# EAGLE schematic apu_module (EAGLE 6.5.0)
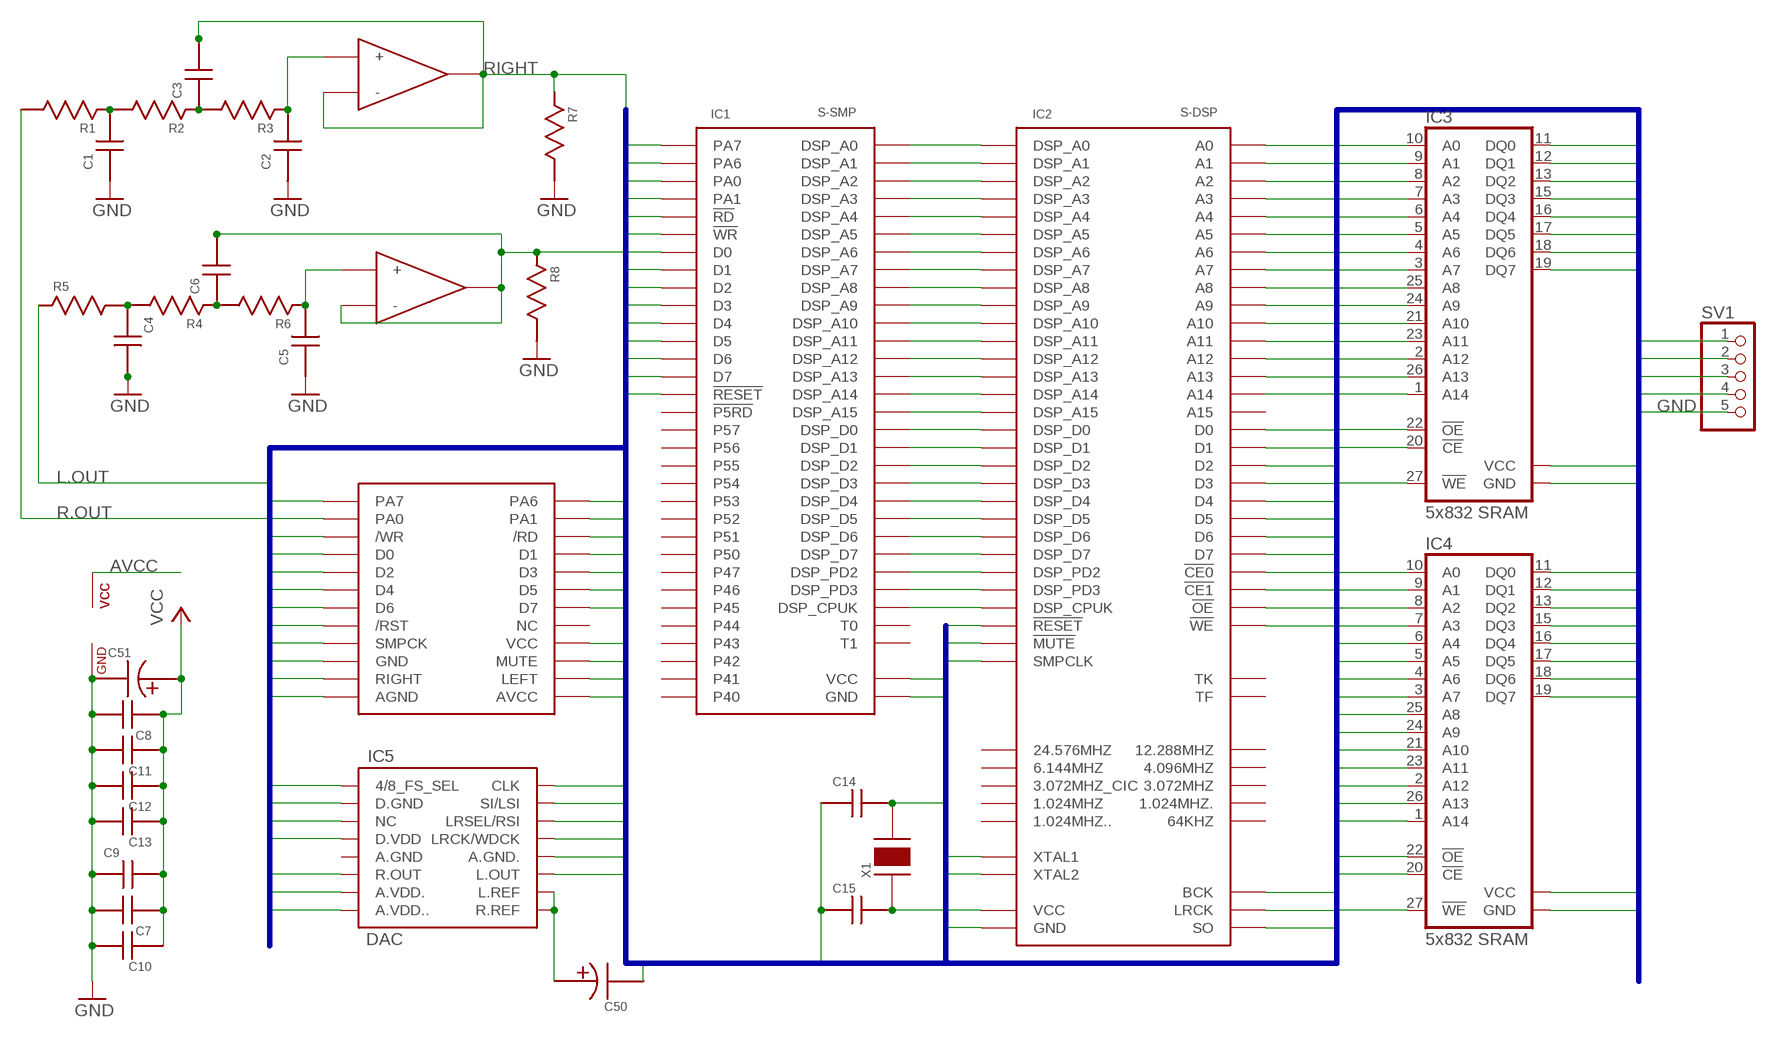
[diagram p0: schematic, sheet 1]

## Parts
C1  C0805  [C0805]
C2  C0805  [C0805]
C3  C0805  [C0805]
C4  C0805  [C0805]
C5  C0805  [C0805]
C6  C0805  [C0805]
C7  C0805  [C0805]
C8  C0805  [C0805]
C9  C0805  [C0805]
C10  C0805  [C0805]
C11  C0805  [C0805]
C12  C0805  [C0805]
C13  C0805  [C0805]
C14  C0805  [C0805]
C15  C0805  [C0805]
C50  CAPACITOR  [TT5D6]
C51  CAPACITOR  [TT5D6]
E$3  APU  [APU]
IC1  S-SMP  [QFP64_SOT319]
IC2  S-DSP  [QFP80_SOT318]
IC3  5x832 SRAM  SRAM  [SO28X]
IC4  5x832 SRAM  SRAM  [SO28X]
IC5  DAC  UPD6376  [SO16W]
IC6  LM2904  [SO-08]
R1  R0805  [R0805]
R2  R0805  [R0805]
R3  R0805  [R0805]
R4  R0805  [R0805]
R5  R0805  [R0805]
R6  R0805  [R0805]
R7  R0805  [R0805]
R8  R0805  [R0805]
SV1  PINHD-1X5  [1X05]
X1  CRYSTAL  [QS]

## Nets
!CE0: IC2.28(!CE0) IC3.20(!CE)
!CE1: IC2.27(!CE1) IC4.20(!CE)
!MUTE [Power]: E$3.P$20(MUTE) IC2.39(!MUTE)
!OE: IC2.30(!OE) IC3.22(!OE) IC4.22(!OE)
!P_RD: E$3.P$6(/RD) IC1.46(!RD)
!P_WR: E$3.P$5(/WR) IC1.47(!WR)
!RESET: E$3.P$15(/RST) IC1.37(!RESET) IC2.47(!RESET)
!WE: IC2.36(!WE) IC3.27(!WE) IC4.27(!WE)
A0: IC2.9(A0) IC3.10(A0) IC4.10(A0)
A1: IC2.10(A1) IC3.9(A1) IC4.9(A1)
A2: IC2.11(A2) IC3.8(A2) IC4.8(A2)
A3: IC2.13(A3) IC3.7(A3) IC4.7(A3)
A4: IC2.14(A4) IC3.6(A4) IC4.6(A4)
A5: IC2.15(A5) IC3.5(A5) IC4.5(A5)
A6: IC2.16(A6) IC3.4(A6) IC4.4(A6)
A7: IC2.17(A7) IC3.3(A7) IC4.3(A7)
A8: IC2.34(A8) IC3.25(A8) IC4.25(A8)
A9: IC2.32(A9) IC3.24(A9) IC4.24(A9)
A10: IC2.29(A10) IC3.21(A10) IC4.21(A10)
A11: IC2.31(A11) IC3.23(A11) IC4.23(A11)
A12: IC2.18(A12) IC3.2(A12) IC4.2(A12)
A13: IC2.35(A13) IC3.26(A13) IC4.26(A13)
A14: IC2.19(A14) IC3.1(A14) IC4.1(A14)
A.REF [Power]: C50.+ IC5.9(R.REF) IC5.10(L.REF)
AVCC [Audio]: E$3.P$24(AVCC) IC6.8(SUPPLY:VCC)
BCK: IC2.42(BCK) IC5.16(CLK) SV1.4
D0: IC2.8(D0) IC3.11(DQ0) IC4.11(DQ0)
D1: IC2.7(D1) IC3.12(DQ1) IC4.12(DQ1)
D2: IC2.6(D2) IC3.13(DQ2) IC4.13(DQ2)
D3: IC2.22(D3) IC3.15(DQ3) IC4.15(DQ3)
D4: IC2.23(D4) IC3.16(DQ4) IC4.16(DQ4)
D5: IC2.24(D5) IC3.17(DQ5) IC4.17(DQ5)
D6: IC2.25(D6) IC3.18(DQ6) IC4.18(DQ6)
D7: IC2.26(D7) IC3.19(DQ7) IC4.19(DQ7)
DSP_A0: IC1.5(DSP_A0) IC2.60(DSP_A0)
DSP_A1: IC1.4(DSP_A1) IC2.61(DSP_A1)
DSP_A2: IC1.3(DSP_A2) IC2.62(DSP_A2)
DSP_A3: IC1.2(DSP_A3) IC2.63(DSP_A3)
DSP_A4: IC1.1(DSP_A4) IC2.64(DSP_A4)
DSP_A5: IC1.64(DSP_A5) IC2.65(DSP_A5)
DSP_A6: IC1.63(DSP_A6) IC2.66(DSP_A6)
DSP_A7: IC1.62(DSP_A7) IC2.67(DSP_A7)
DSP_A8: IC1.61(DSP_A8) IC2.68(DSP_A8)
DSP_A9: IC1.60(DSP_A9) IC2.69(DSP_A9)
DSP_A10: IC1.59(DSP_A10) IC2.70(DSP_A10)
DSP_A11: IC1.56(DSP_A11) IC2.71(DSP_A11)
DSP_A12: IC1.55(DSP_A12) IC2.72(DSP_A12)
DSP_A13: IC1.54(DSP_A13) IC2.74(DSP_A13)
DSP_A14: IC1.53(DSP_A14) IC2.75(DSP_A14)
DSP_A15: IC1.52(DSP_A15) IC2.76(DSP_A15)
DSP_CPUK: IC1.16(DSP_CPUK) IC2.48(DSP_CPUK)
DSP_D0: IC1.13(DSP_D0) IC2.51(DSP_D0)
DSP_D1: IC1.12(DSP_D1) IC2.53(DSP_D1)
DSP_D2: IC1.11(DSP_D2) IC2.54(DSP_D2)
DSP_D3: IC1.10(DSP_D3) IC2.55(DSP_D3)
DSP_D4: IC1.9(DSP_D4) IC2.56(DSP_D4)
DSP_D5: IC1.8(DSP_D5) IC2.57(DSP_D5)
DSP_D6: IC1.7(DSP_D6) IC2.58(DSP_D6)
DSP_D7: IC1.6(DSP_D7) IC2.59(DSP_D7)
DSP_PD2: IC1.15(DSP_PD2) IC2.49(DSP_PD2)
DSP_PD3: IC1.14(DSP_PD3) IC2.50(DSP_PD3)
GND [Power]: C1.1 C2.1 C4.2 C5.1 C7.2 C8.2 C9.1 C10.2 C11.2 C12.2 C13.2 C14.1 C15.1 C50.- C51.- E$3.P$19(GND) E$3.P$23(AGND) IC1.26(GND) IC1.58(GND) IC2.12(GND) IC2.52(GND) IC3.14(GND) IC4.14(GND) IC5.1(4/8_FS_SEL) IC5.2(D.GND) IC5.12(A.GND.) IC5.14(LRSEL/RSI) IC6.4(SUPPLY:GND) R7.2 R8.2 SV1.5
L1 [Audio]: C4.1 R4.2 R5.2
L2 [Audio]: C6.1 R4.1 R6.2
L3 [Audio]: C5.2 IC6.5(+) R6.1
L.OUT [Audio]: IC5.11(L.OUT) R5.1
LEFT [Audio]: C6.2 E$3.P$21(LEFT) IC6.6(-) IC6.7(OUT) R8.1
LRCK: IC2.43(LRCK) IC5.13(LRCK/WDCK) SV1.3
PA0: E$3.P$3(PA0) IC1.49(PA0)
PA1: E$3.P$4(PA1) IC1.48(PA1)
PA6: E$3.P$2(PA6) IC1.50(PA6)
PA7: E$3.P$1(PA7) IC1.51(PA7)
PD0: E$3.P$7(D0) IC1.45(D0)
PD1: E$3.P$8(D1) IC1.44(D1)
PD2: E$3.P$9(D2) IC1.43(D2)
PD3: E$3.P$10(D3) IC1.42(D3)
PD4: E$3.P$11(D4) IC1.41(D4)
PD5: E$3.P$12(D5) IC1.40(D5)
PD6: E$3.P$13(D6) IC1.39(D6)
PD7: E$3.P$14(D7) IC1.38(D7)
R1 [Audio]: C1.2 R1.1 R2.2
R2 [Audio]: C3.1 R2.1 R3.2
R3 [Audio]: C2.2 IC6.3(+) R3.1
R.OUT [Audio]: IC5.6(R.OUT) R1.2
RIGHT [Audio]: C3.2 E$3.P$22(RIGHT) IC6.1(OUT) IC6.2(-) R7.1
SMPCLK: E$3.P$17(SMPCK) IC2.78(SMPCLK)
SO: IC2.44(SO) IC5.15(SI/LSI) SV1.2
VCC [Power]: C7.1 C8.1 C9.2 C10.1 C11.1 C12.1 C13.1 C51.+ E$3.P$18(VCC) IC1.57(VCC) IC2.33(VCC) IC2.73(VCC) IC3.28(VCC) IC4.28(VCC) IC5.3(NC) IC5.4(D.VDD) IC5.7(A.VDD.) IC5.8(A.VDD..) SV1.1
XTAL1: C15.2 IC2.45(XTAL1) X1.1
XTAL2: C14.2 IC2.46(XTAL2) X1.2
Unconnected: E$3.P$16(NC) IC1.17(!P5RD) IC1.18(P57) IC1.19(P56) IC1.20(P55) IC1.21(P54) IC1.22(P53) IC1.23(P52) IC1.24(P51) IC1.25(P50) IC1.27(P47) IC1.28(P46) IC1.29(P45) IC1.30(P44) IC1.31(P43) IC1.32(P42) IC1.33(P41) IC1.34(P40) IC1.35(T1) IC1.36(T0) IC2.1(4.096MHZ) IC2.2(3.072MHZ) IC2.3(1.024MHZ) IC2.4(1.024MHZ.) IC2.5(1.024MHZ..) IC2.20(A15) IC2.37(TF) IC2.38(TK) IC2.40(64KHZ) IC2.41(3.072MHZ_CIC) IC2.77(24.576MHZ) IC2.79(12.288MHZ) IC2.80(6.144MHZ) IC5.5(A.GND)

## Buses
PA[0..7],PD[0..7],!P_RD,!P_WR,!RESET,!MUTE,SMPCLK,LEFT,RIGHT,GND,VCC,XTAL1,XTAL2,A[0..14],D[0..7],!CE0,!CE1,!OE,!WE,L.OUT,R.OUT,BCK,LRCK,SO,AVCC

## Library data of the parts
C1-C15 = apu_pcb:C0805
C50 C51 = apu_pcb:CAPACITOR
E$3 = apu_pcb:APU
IC1 = apu_pcb:S-SMP
IC2 = apu_pcb:S-DSP
IC3 IC4 = apu_pcb:SRAM
IC5 = apu_pcb:UPD6376
IC6 = apu_pcb:LM2904
R1-R8 = apu_pcb:R0805
SV1 = pinhead:PINHD-1X5: PIN HEADER
X1 = apu_pcb:CRYSTAL

## Net classes
1 Power: width 0.406 mm
2 Audio: width 0.406 mm